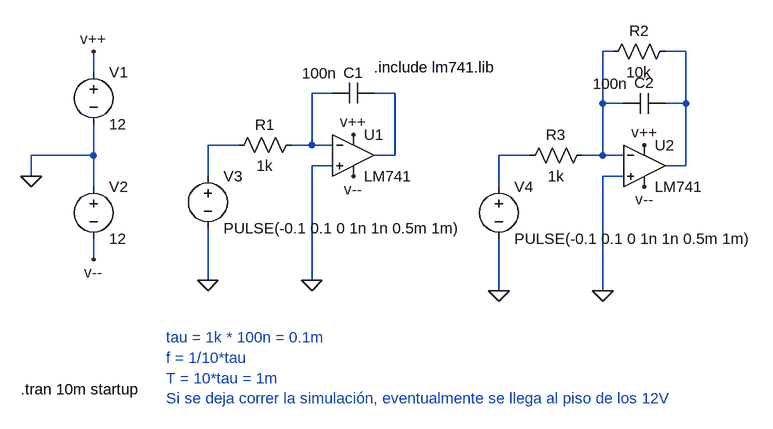
[diagram p0: schematic Simu punto B.asc]
Simu punto B.asc, the LTspice schematic file:
Version 4
SHEET 1 880 680
WIRE 608 16 592 16
WIRE 720 16 688 16
WIRE -192 48 -192 16
WIRE 176 80 144 80
WIRE 272 80 240 80
WIRE 592 96 592 16
WIRE 624 96 592 96
WIRE 720 96 720 16
WIRE 720 96 688 96
WIRE 32 160 -16 160
WIRE 144 160 144 80
WIRE 144 160 112 160
WIRE 176 160 144 160
WIRE -192 176 -192 128
WIRE -192 176 -288 176
WIRE 272 176 272 80
WIRE 272 176 240 176
WIRE 480 176 432 176
WIRE 592 176 592 96
WIRE 592 176 560 176
WIRE 624 176 592 176
WIRE 176 192 144 192
WIRE 720 192 720 96
WIRE 720 192 688 192
WIRE -288 208 -288 176
WIRE -16 208 -16 160
WIRE 624 208 592 208
WIRE -192 224 -192 176
WIRE 432 224 432 176
WIRE -192 336 -192 304
WIRE -16 368 -16 288
WIRE 144 368 144 192
WIRE 432 384 432 304
WIRE 592 384 592 208
FLAG -288 208 0
FLAG -16 368 0
FLAG 144 368 0
FLAG -192 16 v++
FLAG 208 144 v++
FLAG -192 336 v--
FLAG 208 208 v--
FLAG 432 384 0
FLAG 592 384 0
FLAG 656 160 v++
FLAG 656 224 v--
SYMBOL OpAmps\\opamp2 208 112 R0
SYMATTR InstName U1
SYMATTR Value LM741
SYMBOL voltage -192 32 R0
WINDOW 123 0 0 Left 0
WINDOW 39 0 0 Left 0
SYMATTR InstName V1
SYMATTR Value 12
SYMBOL voltage -192 208 R0
WINDOW 123 0 0 Left 0
WINDOW 39 0 0 Left 0
SYMATTR InstName V2
SYMATTR Value 12
SYMBOL cap 240 64 R90
WINDOW 0 0 32 VBottom 2
WINDOW 3 -30 84 VTop 2
SYMATTR InstName C1
SYMATTR Value 100n
SYMBOL res 128 144 R90
WINDOW 0 0 56 VBottom 2
WINDOW 3 32 56 VTop 2
SYMATTR InstName R1
SYMATTR Value 1k
SYMBOL voltage -16 192 R0
WINDOW 123 0 0 Left 0
WINDOW 39 0 0 Left 0
SYMATTR InstName V3
SYMATTR Value PULSE(-0.1 0.1 0 1n 1n 0.5m 1m)
SYMBOL res 704 0 R90
WINDOW 0 0 56 VBottom 2
WINDOW 3 32 56 VTop 2
SYMATTR InstName R2
SYMATTR Value 10k
SYMBOL OpAmps\\opamp2 656 128 R0
SYMATTR InstName U2
SYMATTR Value LM741
SYMBOL cap 688 80 R90
WINDOW 0 0 32 VBottom 2
WINDOW 3 -30 84 VTop 2
SYMATTR InstName C2
SYMATTR Value 100n
SYMBOL res 576 160 R90
WINDOW 0 0 56 VBottom 2
WINDOW 3 32 56 VTop 2
SYMATTR InstName R3
SYMATTR Value 1k
SYMBOL voltage 432 208 R0
WINDOW 123 0 0 Left 0
WINDOW 39 0 0 Left 0
SYMATTR InstName V4
SYMATTR Value PULSE(-0.1 0.1 0 1n 1n 0.5m 1m)
TEXT 240 40 Left 2 !.include lm741.lib
TEXT -80 456 Left 2 ;tau = 1k * 100n = 0.1m\nf = 1/10*tau\nT = 10*tau = 1m\nSi se deja correr la simulación, eventualmente se llega al piso de los 12V
TEXT -304 536 Left 2 !.tran 10m startup

The netlist it stands for:
* Simu punto B.asc
XU1 0 N003 v++ v-- N004 LM741  ; pins In+ In- V+ V- OUT
V1 v++ 0 12
V2 0 v-- 12
C1 N004 N003 100n
R1 N003 N005 1k
V3 N005 0 PULSE(-0.1 0.1 0 1n 1n 0.5m 1m)
R2 N002 N001 10k
XU2 0 N001 v++ v-- N002 LM741  ; pins In+ In- V+ V- OUT
C2 N002 N001 100n
R3 N001 N006 1k
V4 N006 0 PULSE(-0.1 0.1 0 1n 1n 0.5m 1m)
.include lm741.lib
* tau = 1k * 100n = 0.1m
* f = 1/10*tau
* T = 10*tau = 1m
* Si se deja correr la simulación, eventualmente se llega al piso de los 12V
.tran 10m startup
.backanno
.end